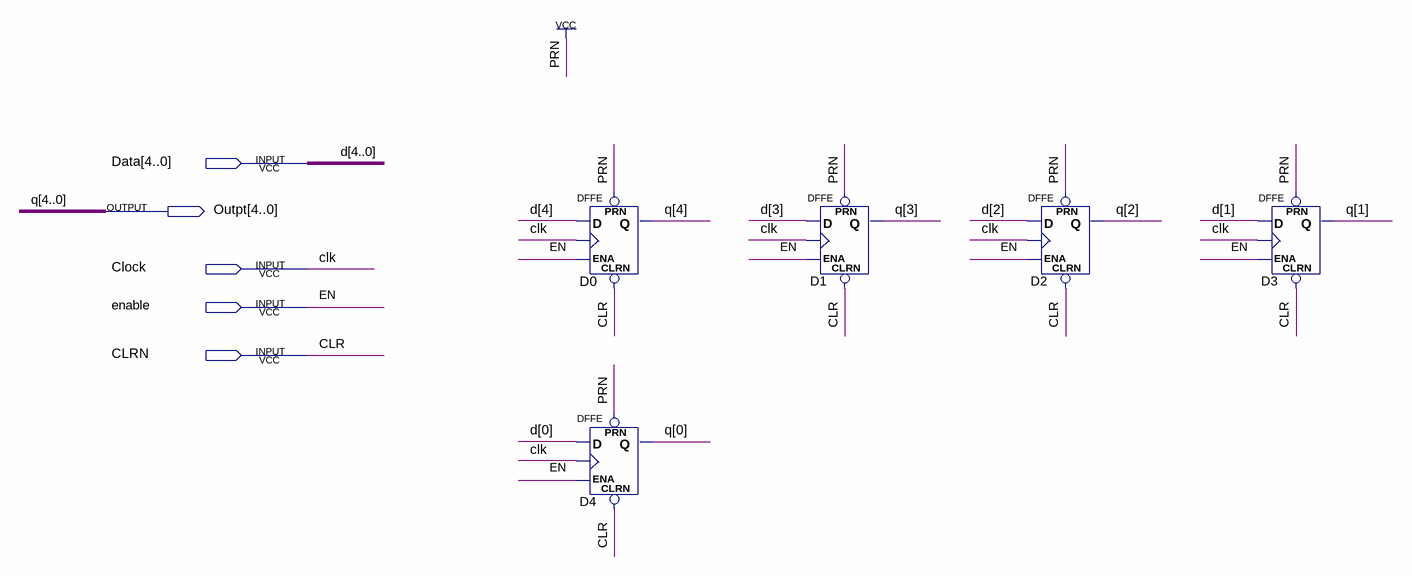
[diagram p0: schematic sheet]
// Quartus schematic Fivebitreg.bdf as structural Verilog: 5 symbols, 5 pins
module Fivebitreg (
  input  [4:0] Data,
  input  Clock,
  input  enable,
  input  CLRN,
  output [4:0] Outpt
);

  DFFE D0 (.PRN(1'b1), .CLRN(CLRN), .D(Data[4]), .CLK(Clock), .ENA(enable), .Q(Outpt[4]));
  DFFE D4 (.PRN(1'b1), .CLRN(CLRN), .D(Data[0]), .CLK(Clock), .ENA(enable), .Q(Outpt[0]));
  DFFE D1 (.PRN(1'b1), .CLRN(CLRN), .D(Data[3]), .CLK(Clock), .ENA(enable), .Q(Outpt[3]));
  DFFE D2 (.PRN(1'b1), .CLRN(CLRN), .D(Data[2]), .CLK(Clock), .ENA(enable), .Q(Outpt[2]));
  DFFE D3 (.PRN(1'b1), .CLRN(CLRN), .D(Data[1]), .CLK(Clock), .ENA(enable), .Q(Outpt[1]));

  // Other names for the same wires on the sheet: clk = Clock; CLR = CLRN; d[4:0] = Data; EN = enable; q[4:0] = Outpt
endmodule
